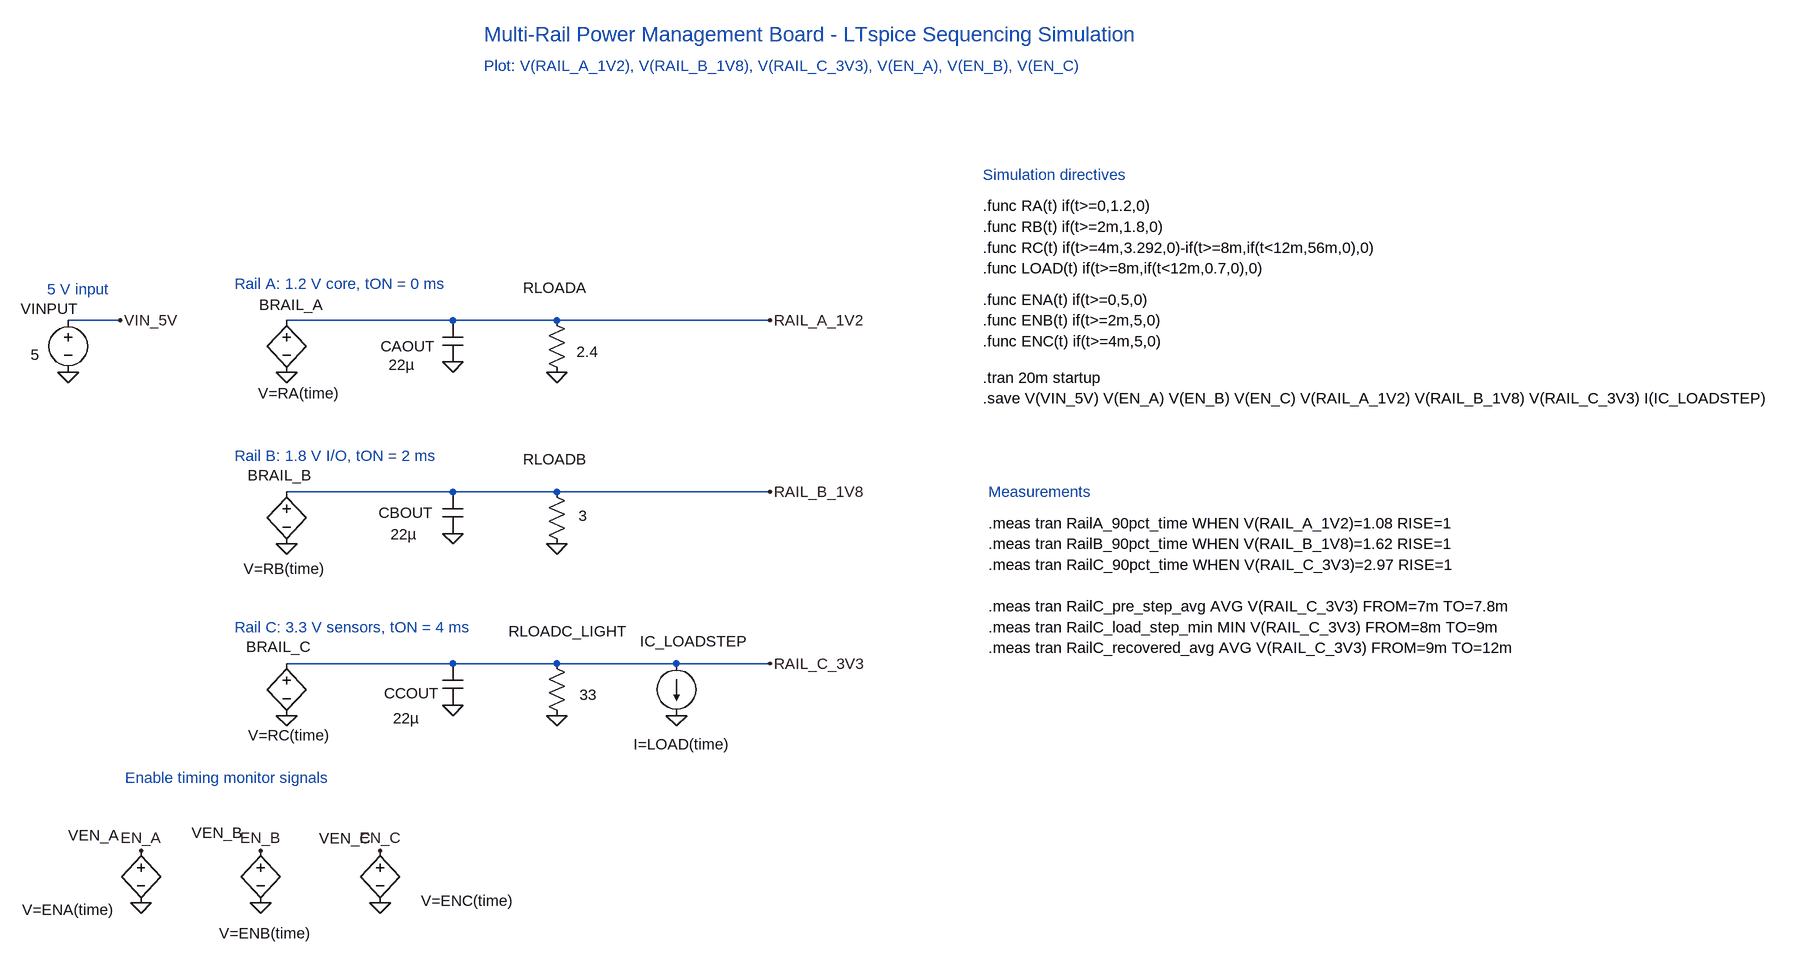
[diagram p0: schematic PowerRails_Behavioral_Complete.asc]
PowerRails_Behavioral_Complete.asc, the LTspice schematic file:
Version 4.1
SHEET 1 2788 1300
WIRE 184 320 104 320
WIRE 696 320 440 320
WIRE 856 320 696 320
WIRE 1184 320 856 320
WIRE 696 584 440 584
WIRE 856 584 696 584
WIRE 1184 584 856 584
WIRE 696 848 440 848
WIRE 856 848 696 848
WIRE 1040 848 856 848
WIRE 1184 848 1040 848
FLAG 184 320 VIN_5V
FLAG 104 400 0
FLAG 440 400 0
FLAG 696 384 0
FLAG 856 400 0
FLAG 1184 320 RAIL_A_1V2
FLAG 440 664 0
FLAG 696 648 0
FLAG 856 664 0
FLAG 1184 584 RAIL_B_1V8
FLAG 440 928 0
FLAG 696 912 0
FLAG 856 928 0
FLAG 1040 928 0
FLAG 1184 848 RAIL_C_3V3
FLAG 216 1136 EN_A
FLAG 216 1216 0
FLAG 400 1136 EN_B
FLAG 400 1216 0
FLAG 584 1136 EN_C
FLAG 584 1216 0
SYMBOL voltage 104 304 R0
WINDOW 0 -73 -2 Left 2
WINDOW 3 -58 69 Left 2
SYMATTR InstName VINPUT
SYMATTR Value 5
SYMBOL bv 440 304 R0
WINDOW 0 -42 -8 Left 2
WINDOW 3 -44 128 Left 2
SYMATTR InstName BRAIL_A
SYMATTR Value V=RA(time)
SYMBOL cap 680 320 R0
WINDOW 0 -95 40 Left 2
WINDOW 3 -83 68 Left 2
SYMATTR InstName CAOUT
SYMATTR Value 22µ
SYMBOL res 840 304 R0
WINDOW 0 -36 -34 Left 2
WINDOW 3 46 64 Left 2
SYMATTR InstName RLOADA
SYMATTR Value 2.4
SYMBOL bv 440 568 R0
WINDOW 0 -60 -10 Left 2
WINDOW 3 -66 134 Left 2
SYMATTR InstName BRAIL_B
SYMATTR Value V=RB(time)
SYMBOL cap 680 584 R0
WINDOW 0 -98 32 Left 2
WINDOW 3 -80 65 Left 2
SYMATTR InstName CBOUT
SYMATTR Value 22µ
SYMBOL res 840 568 R0
WINDOW 0 -36 -34 Left 2
WINDOW 3 49 53 Left 2
SYMATTR InstName RLOADB
SYMATTR Value 3
SYMBOL bv 440 832 R0
WINDOW 0 -62 -10 Left 2
WINDOW 3 -59 126 Left 2
SYMATTR InstName BRAIL_C
SYMATTR Value V=RC(time)
SYMBOL cap 680 848 R0
WINDOW 0 -90 46 Left 2
WINDOW 3 -76 84 Left 2
SYMATTR InstName CCOUT
SYMATTR Value 22µ
SYMBOL res 840 832 R0
WINDOW 0 -58 -34 Left 2
WINDOW 3 51 64 Left 2
SYMATTR InstName RLOADC_LIGHT
SYMATTR Value 33
SYMBOL current 1040 848 R0
WINDOW 0 -56 -34 Left 2
WINDOW 3 -66 124 Left 2
SYMATTR InstName IC_LOADSTEP
SYMATTR Value I=LOAD(time)
SYMBOL bv 216 1120 R0
WINDOW 0 -112 -8 Left 2
WINDOW 3 -183 107 Left 2
SYMATTR InstName VEN_A
SYMATTR Value V=ENA(time)
SYMBOL bv 400 1120 R0
WINDOW 0 -106 -12 Left 2
WINDOW 3 -64 143 Left 2
SYMATTR InstName VEN_B
SYMATTR Value V=ENB(time)
SYMBOL bv 584 1120 R0
WINDOW 0 -94 -3 Left 2
WINDOW 3 63 93 Left 2
SYMATTR InstName VEN_C
SYMATTR Value V=ENC(time)
TEXT 744 -120 Left 3 ;Multi-Rail Power Management Board - LTspice Sequencing Simulation
TEXT 744 -72 Left 2 ;Plot: V(RAIL_A_1V2), V(RAIL_B_1V8), V(RAIL_C_3V3), V(EN_A), V(EN_B), V(EN_C)
TEXT 72 272 Left 2 ;5 V input
TEXT 360 264 Left 2 ;Rail A: 1.2 V core, tON = 0 ms
TEXT 360 528 Left 2 ;Rail B: 1.8 V I/O, tON = 2 ms
TEXT 360 792 Left 2 ;Rail C: 3.3 V sensors, tON = 4 ms
TEXT 192 1024 Left 2 ;Enable timing monitor signals
TEXT 1512 96 Left 2 ;Simulation directives
TEXT 1512 144 Left 2 !.func RA(t) if(t>=0,1.2,0)
TEXT 1512 176 Left 2 !.func RB(t) if(t>=2m,1.8,0)
TEXT 1512 208 Left 2 !.func RC(t) if(t>=4m,3.292,0)-if(t>=8m,if(t<12m,56m,0),0)
TEXT 1512 240 Left 2 !.func LOAD(t) if(t>=8m,if(t<12m,0.7,0),0)
TEXT 1512 288 Left 2 !.func ENA(t) if(t>=0,5,0)
TEXT 1512 320 Left 2 !.func ENB(t) if(t>=2m,5,0)
TEXT 1512 352 Left 2 !.func ENC(t) if(t>=4m,5,0)
TEXT 1512 408 Left 2 !.tran 20m startup
TEXT 1512 440 Left 2 !.save V(VIN_5V) V(EN_A) V(EN_B) V(EN_C) V(RAIL_A_1V2) V(RAIL_B_1V8) V(RAIL_C_3V3) I(IC_LOADSTEP)
TEXT 1520 584 Left 2 ;Measurements
TEXT 1520 632 Left 2 !.meas tran RailA_90pct_time WHEN V(RAIL_A_1V2)=1.08 RISE=1
TEXT 1520 664 Left 2 !.meas tran RailB_90pct_time WHEN V(RAIL_B_1V8)=1.62 RISE=1
TEXT 1520 696 Left 2 !.meas tran RailC_90pct_time WHEN V(RAIL_C_3V3)=2.97 RISE=1
TEXT 1520 760 Left 2 !.meas tran RailC_pre_step_avg AVG V(RAIL_C_3V3) FROM=7m TO=7.8m
TEXT 1520 792 Left 2 !.meas tran RailC_load_step_min MIN V(RAIL_C_3V3) FROM=8m TO=9m
TEXT 1520 824 Left 2 !.meas tran RailC_recovered_avg AVG V(RAIL_C_3V3) FROM=9m TO=12m

The netlist it stands for:
* PowerRails_Behavioral_Complete.asc
VINPUT VIN_5V 0 5
BRAIL_A RAIL_A_1V2 0 V=RA(time)
CAOUT RAIL_A_1V2 0 22µ
RLOADA RAIL_A_1V2 0 2.4
BRAIL_B RAIL_B_1V8 0 V=RB(time)
CBOUT RAIL_B_1V8 0 22µ
RLOADB RAIL_B_1V8 0 3
BRAIL_C RAIL_C_3V3 0 V=RC(time)
CCOUT RAIL_C_3V3 0 22µ
RLOADC_LIGHT RAIL_C_3V3 0 33
IC_LOADSTEP RAIL_C_3V3 0 I=LOAD(time)
B§VEN_A EN_A 0 V=ENA(time)
B§VEN_B EN_B 0 V=ENB(time)
B§VEN_C EN_C 0 V=ENC(time)
* Multi-Rail Power Management Board - LTspice Sequencing Simulation
* Plot: V(RAIL_A_1V2), V(RAIL_B_1V8), V(RAIL_C_3V3), V(EN_A), V(EN_B), V(EN_C)
* 5 V input
* Rail A: 1.2 V core, tON = 0 ms
* Rail B: 1.8 V I/O, tON = 2 ms
* Rail C: 3.3 V sensors, tON = 4 ms
* Enable timing monitor signals
* Simulation directives
.func RA(t) if(t>=0,1.2,0)
.func RB(t) if(t>=2m,1.8,0)
.func RC(t) if(t>=4m,3.292,0)-if(t>=8m,if(t<12m,56m,0),0)
.func LOAD(t) if(t>=8m,if(t<12m,0.7,0),0)
.func ENA(t) if(t>=0,5,0)
.func ENB(t) if(t>=2m,5,0)
.func ENC(t) if(t>=4m,5,0)
.tran 20m startup
.save V(VIN_5V) V(EN_A) V(EN_B) V(EN_C) V(RAIL_A_1V2) V(RAIL_B_1V8) V(RAIL_C_3V3) I(IC_LOADSTEP)
* Measurements
.meas tran RailA_90pct_time WHEN V(RAIL_A_1V2)=1.08 RISE=1
.meas tran RailB_90pct_time WHEN V(RAIL_B_1V8)=1.62 RISE=1
.meas tran RailC_90pct_time WHEN V(RAIL_C_3V3)=2.97 RISE=1
.meas tran RailC_pre_step_avg AVG V(RAIL_C_3V3) FROM=7m TO=7.8m
.meas tran RailC_load_step_min MIN V(RAIL_C_3V3) FROM=8m TO=9m
.meas tran RailC_recovered_avg AVG V(RAIL_C_3V3) FROM=9m TO=12m
.backanno
.end